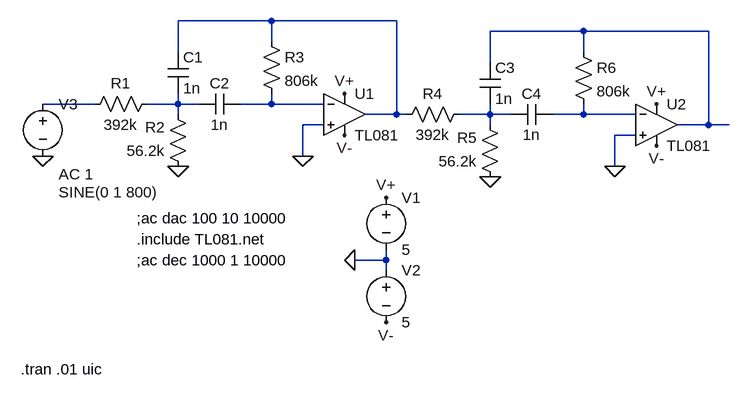
[diagram p0: schematic filtro3.asc]
filtro3.asc, the LTspice schematic file:
Version 4
SHEET 1 1200 680
WIRE 256 -32 112 -32
WIRE 448 -32 256 -32
WIRE 736 -16 592 -16
WIRE 928 -16 736 -16
WIRE 256 0 256 -32
WIRE 112 16 112 -32
WIRE 736 16 736 -16
WIRE 592 32 592 -16
WIRE -16 96 -96 96
WIRE 112 96 112 80
WIRE 112 96 64 96
WIRE 144 96 112 96
WIRE 256 96 256 80
WIRE 256 96 208 96
WIRE 336 96 256 96
WIRE 112 112 112 96
WIRE 448 112 448 -32
WIRE 448 112 400 112
WIRE 464 112 448 112
WIRE 592 112 592 96
WIRE 592 112 544 112
WIRE 624 112 592 112
WIRE 736 112 736 96
WIRE 736 112 688 112
WIRE 816 112 736 112
WIRE 336 128 304 128
WIRE 592 128 592 112
WIRE 928 128 928 -16
WIRE 928 128 880 128
WIRE 960 128 928 128
WIRE 816 144 784 144
WIRE 304 176 304 128
WIRE 784 192 784 144
WIRE 432 336 432 320
WIRE 432 336 384 336
WIRE 432 352 432 336
FLAG 384 336 0
FLAG 432 432 V-
FLAG 432 240 V+
FLAG 368 80 V+
FLAG 368 144 V-
FLAG 112 192 0
FLAG 304 176 0
FLAG -96 176 0
FLAG 848 96 V+
FLAG 848 160 V-
FLAG 592 208 0
FLAG 784 192 0
SYMBOL res 80 80 R90
WINDOW 0 0 56 VBottom 2
WINDOW 3 32 56 VTop 2
SYMATTR InstName R1
SYMATTR Value 392k
SYMBOL res 128 208 R180
WINDOW 0 36 76 Left 2
WINDOW 3 36 40 Left 2
SYMATTR InstName R2
SYMATTR Value 56.2k
SYMBOL res 240 -16 R0
SYMATTR InstName R3
SYMATTR Value 806k
SYMBOL cap 96 16 R0
SYMATTR InstName C1
SYMATTR Value 1n
SYMBOL cap 208 80 R90
WINDOW 0 0 32 VBottom 2
WINDOW 3 32 32 VTop 2
SYMATTR InstName C2
SYMATTR Value 1n
SYMBOL Opamps\\opamp2 368 48 R0
SYMATTR InstName U1
SYMATTR Value TL081
SYMBOL voltage 432 224 R0
WINDOW 123 0 0 Left 2
WINDOW 39 0 0 Left 2
SYMATTR InstName V1
SYMATTR Value 5
SYMBOL voltage 432 336 R0
WINDOW 123 0 0 Left 2
WINDOW 39 0 0 Left 2
SYMATTR InstName V2
SYMATTR Value 5
SYMBOL voltage -96 80 R0
WINDOW 123 24 124 Left 2
WINDOW 39 0 0 Left 2
WINDOW 3 24 152 Left 2
SYMATTR Value2 AC 1
SYMATTR InstName V3
SYMATTR Value SINE(0 1 800)
SYMBOL res 560 96 R90
WINDOW 0 0 56 VBottom 2
WINDOW 3 32 56 VTop 2
SYMATTR InstName R4
SYMATTR Value 392k
SYMBOL res 608 224 R180
WINDOW 0 36 76 Left 2
WINDOW 3 36 40 Left 2
SYMATTR InstName R5
SYMATTR Value 56.2k
SYMBOL res 720 0 R0
SYMATTR InstName R6
SYMATTR Value 806k
SYMBOL cap 576 32 R0
SYMATTR InstName C3
SYMATTR Value 1n
SYMBOL cap 688 96 R90
WINDOW 0 0 32 VBottom 2
WINDOW 3 32 32 VTop 2
SYMATTR InstName C4
SYMATTR Value 1n
SYMBOL Opamps\\opamp2 848 64 R0
SYMATTR InstName U2
SYMATTR Value TL081
TEXT 48 272 Left 2 !;ac dac 100 10 10000
TEXT 48 304 Left 2 !.include TL081.net
TEXT 48 336 Left 2 !;ac dec 1000 1 10000
TEXT -130 504 Left 2 !.tran .01 uic

The netlist it stands for:
* filtro3.asc
R1 N004 N003 392k
R2 0 N004 56.2k
R3 N001 N005 806k
C1 N001 N004 1n
C2 N005 N004 1n
XU1 0 N005 V+ V- N001 TL081  ; pins In+ In- V+ V- OUT
V1 V+ 0 5
V2 0 V- 5
V3 N003 0 SINE(0 1 800) AC 1
R4 N006 N001 392k
R5 0 N006 56.2k
R6 N002 N007 806k
C3 N002 N006 1n
C4 N007 N006 1n
XU2 0 N007 V+ V- N002 TL081  ; pins In+ In- V+ V- OUT
;ac dac 100 10 10000
.include TL081.net
;ac dec 1000 1 10000
.tran .01 uic
.backanno
.end

* Results of the author's LTspice run, read from the files saved beside the schematic
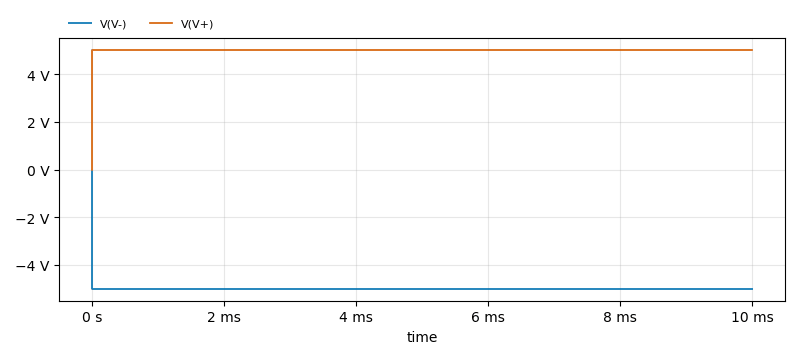
[diagram p1: Transient Analysis of filtro3.asc, plotted from the saved traces]
* Transient Analysis, 1 run:
*   V(V-): min -5 V, max 0 V, average -5 V, rms 5 V, last -5 V
*   V(V+): min 0 V, max 5 V, average 5 V, rms 5 V, last 5 V